# Altium schematic sheet OSC.SchDoc: OSCILATOR
size A4; DocumentNumber: 11; SheetNumber: 11; SheetTotal: 18
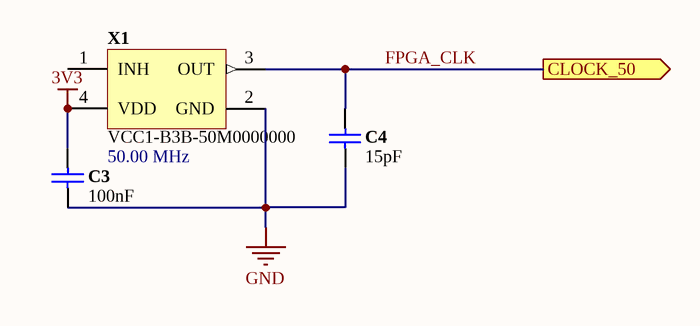
[diagram p0: OSC.SchDoc]

## Parts
C3  100nF  [0805C-GENERIC]
C4  15pF  [0805C-GENERIC]
X1  VCC1-B3B-50M0000000  Frequency: 50.00 MHz  [HOSC-L500HW320H105-4_2]

## Ports
CLOCK_50 (out)

## Nets
3V3: C3.1 X1.4(VDD)
GND: C3.2 C4.2 X1.2(GND)
FPGA_CLK: C4.1 X1.3(OUT) ; port CLOCK_50

Not connected (* = marked no-connect by the designer): X1 1(INH)

## Notes on the sheet
- Title
- Size:
- Date:
- A4
- Number:
- Time:
- Revision:
- Sheet
- of
- File:

## Library data of the parts
C3 C4 = D-101-0027: Capacitor, Ceramic, 10% 10V 0805 X7R; Polarity: Non-Polarized; Dielectric: X7R; Mounting Technology: Surface Mount; Rated Voltage: 10 V; Status: Production; Technology: Ceramic; Tolerance: 10 %; Category: Capacitor
  C3: Capacitance: 100nF
  C4: Capacitance: 15pF
X1 = OSC-4: 50 MHz Oscillator, 3.3V, 15pF; PartNumber: HCX-C2-20M; DefaultDesignator: X?; Class: Oscillators; Output: CMOS; Supply Voltage: 3V3; ComponentLink1Description: Datasheet; ComponentLink1URL: http://www.hongkongcrystal.com/upload/product/original/347881837473.pdf; ComponentLink2Description: Manufacturer; ComponentLink2URL: http://global.kyocera.com/; Type: XO (Standard)